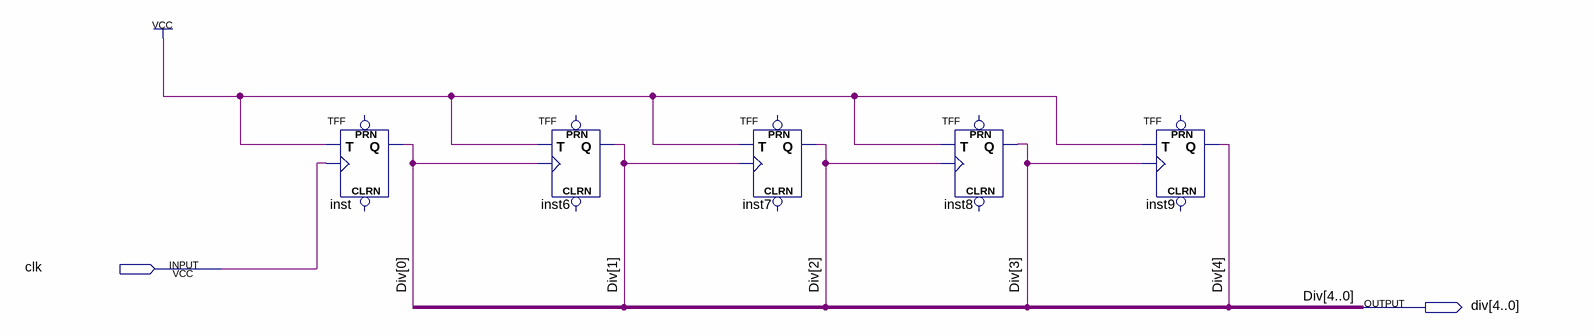
[diagram p0: schematic sheet]
// Quartus schematic Freq_div.bdf as structural Verilog: 5 symbols, 2 pins
module Freq_div (
  input  clk,
  output [4:0] div
);

  TFF inst (.T(1'b1), .CLK(clk), .Q(div[0]));  // open: PRN, CLRN
  TFF inst6 (.T(1'b1), .CLK(div[0]), .Q(div[1]));  // open: PRN, CLRN
  TFF inst7 (.T(1'b1), .CLK(div[1]), .Q(div[2]));  // open: PRN, CLRN
  TFF inst8 (.T(1'b1), .CLK(div[2]), .Q(div[3]));  // open: PRN, CLRN
  TFF inst9 (.T(1'b1), .CLK(div[3]), .Q(div[4]));  // open: PRN, CLRN
endmodule
